# Altium schematic sheet PlugCB.SchDoc
size A; SheetNumber: 1; SheetTotal: 1
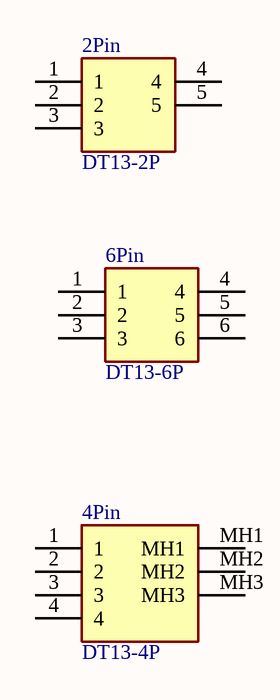
[diagram p0: PlugCB.SchDoc]

## Parts
2Pin  DT13-2P  [DT132P]
4Pin  DT13-4P  [DT134P]
6Pin  DT13-6P  [DT13-6P]

## Nets

Not connected (* = marked no-connect by the designer): 2Pin 1 2 3 4 5; 4Pin 1 2 3 4 MH1 MH2 MH3; 6Pin 1 2 3 4 5 6

## Library data of the parts
2Pin = DT13-2P: Connector; Manufacturer_Name: TE Connectivity; Datasheet Link: https://www.te.com/commerce/DocumentDelivery/DDEController?Action=srchrtrv&DocNm=1-1773962-8&DocType=Data%20Sheet&DocLang=English&PartCntxt=DT13-2P&DocFormat=pdf; Height: 27.43mm; Manufacturer_Part_Number: DT13-2P; Mouser Part Number: 571-DT13-2P; Mouser Price/Stock: https://www.mouser.co.uk/ProductDetail/TE-Connectivity-DEUTSCH/DT13-2P?qs=vkMqrgFpRaiZ8Y45n18x4A%3D%3D; Arrow Part Number: DT13-2P; Arrow Price/Stock: https://www.arrow.com/en/products/dt13-2p/te-connectivity
4Pin = DT13-4P: Connector; Manufacturer_Name: TE Connectivity; Datasheet Link: https://www.te.com/commerce/DocumentDelivery/DDEController?Action=srchrtrv&DocNm=1-1773962-8&DocType=Data%20Sheet&DocLang=English&PartCntxt=DT13-4P&DocFormat=pdf; Height: 36.12mm; Manufacturer_Part_Number: DT13-4P; Mouser Part Number: 571-DT13-4P; Mouser Price/Stock: https://www.mouser.co.uk/ProductDetail/TE-Connectivity-DEUTSCH/DT13-4P?qs=vkMqrgFpRajaLeBfOZKzWQ%3D%3D
6Pin = DT13-6P: Connector; Manufacturer_Name: TE Connectivity; Datasheet Link: https://www.te.com/commerce/DocumentDelivery/DDEController?Action=srchrtrv&DocNm=1-1773962-8&DocType=Data%20Sheet&DocLang=English&PartCntxt=DT13-6P&DocFormat=pdf; Manufacturer_Part_Number: DT13-6P; Mouser Part Number: 571-DT13-6P; Mouser Price/Stock: https://www.mouser.co.uk/ProductDetail/TE-Connectivity-DEUTSCH/DT13-6P?qs=vkMqrgFpRajx%2FDSFtsLl9w%3D%3D